# Altium schematic sheet I2C.SchDoc
size 420 x 297 mm; EDA_Number: ARTIQ; CompanyName: WUT ISE; Organization: WUT ISE; DocumentNumber: 18; SheetNumber: 13; ModifiedBy: -; Title2: I2C devices; ModifiedDate: -
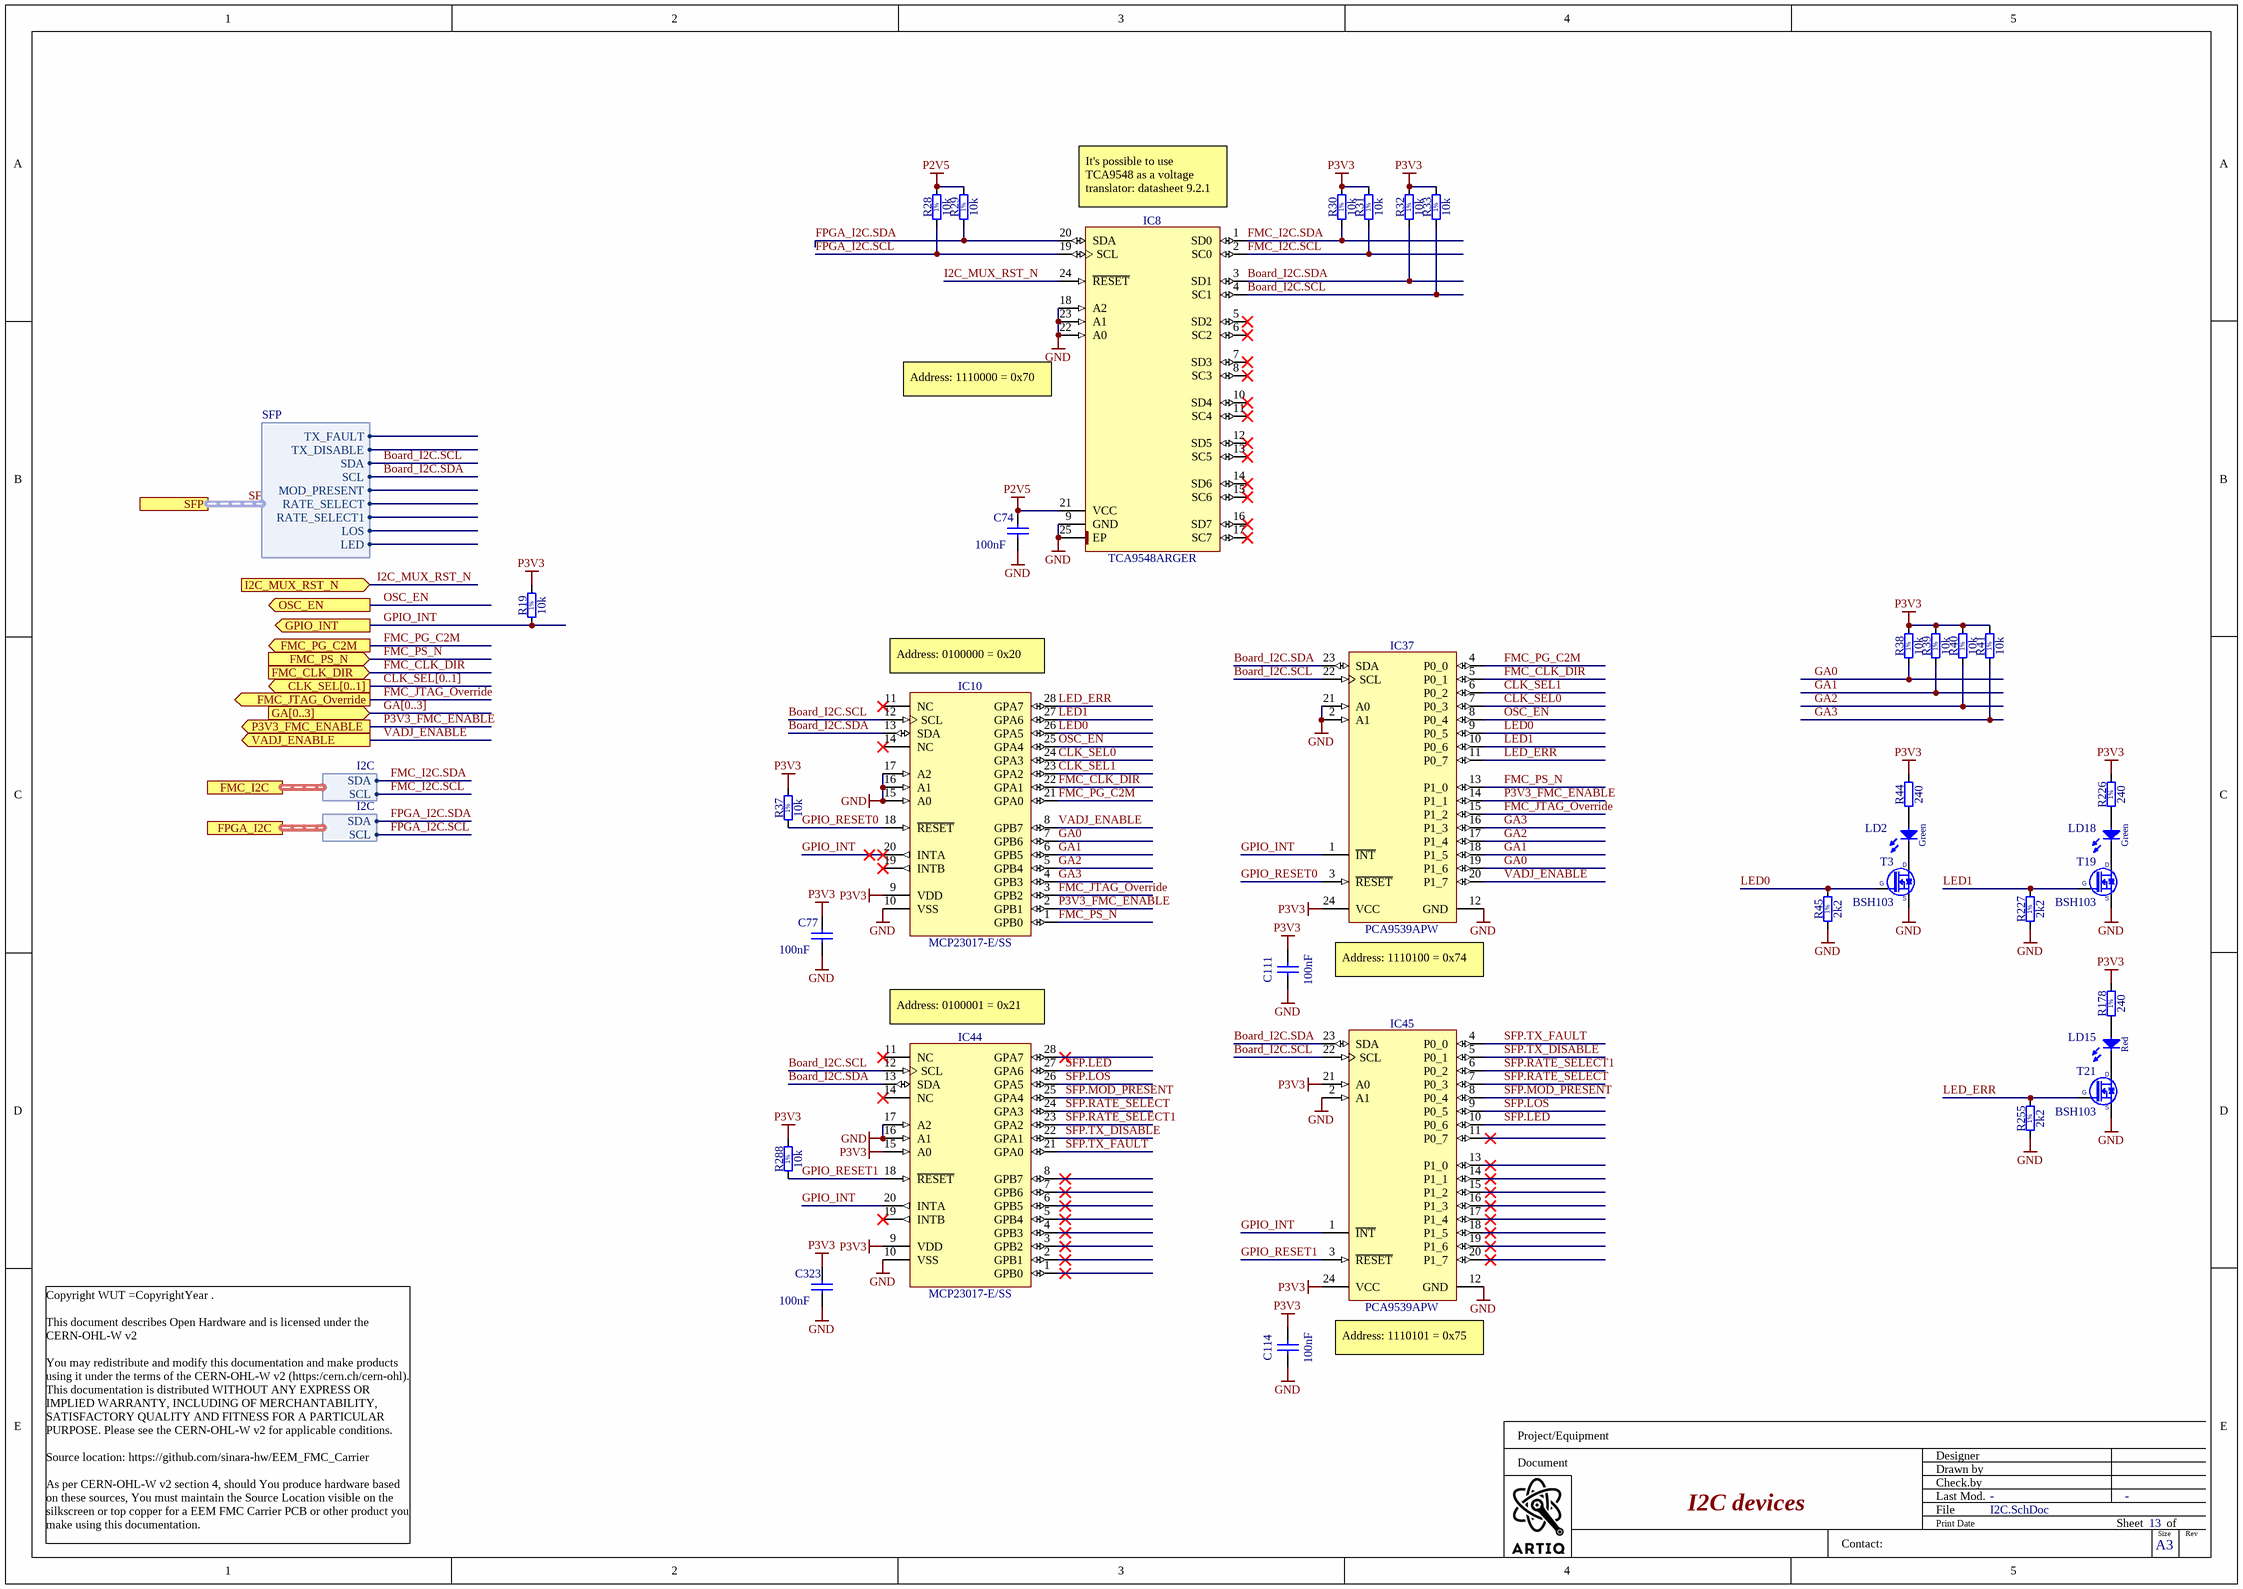
[diagram p0: I2C.SchDoc]

## Parts
C74  100nF  [CAPC1005X55N]
C77  100nF  [CAPC1005X55N]
C111  100nF  [CAPC0603X33N]
C114  100nF  [CAPC0603X33N]
C323  100nF  [CAPC1005X55N]
IC8  TCA9548ARGER  [QFN50P400X400X100-25N-S220]
IC10  MCP23017-E/SS  [SOP65P780X200-28N]
IC37  PCA9539APW  [SOP65P640X110-24N]
IC44  MCP23017-E/SS  [SOP65P780X200-28N]
IC45  PCA9539APW  [SOP65P640X110-24N]
LD2  Green  [LED_AVAGO_HSME-C120]
LD15  Red  [LED_AVAGO_HSMC-C120]
LD18  Green  [LED_AVAGO_HSME-C120]
R19  10k  [RESC1005X40N]
R28  10k  [RESC1005X40N]
R29  10k  [RESC1005X40N]
R30  10k  [RESC1005X40N]
R31  10k  [RESC1005X40N]
R32  10k  [RESC1005X40N]
R33  10k  [RESC1005X40N]
R37  10k  [RESC1005X40N]
R38  10k  [RESC1005X40N]
R39  10k  [RESC1005X40N]
R40  10k  [RESC1005X40N]
R41  10k  [RESC1005X40N]
R44  240  [RESC1005X40N]
R45  2k2  [RESC1005X40N]
R178  240  [RESC1005X40N]
R226  240  [RESC1005X40N]
R227  2k2  [RESC1005X40N]
R255  2k2  [RESC1005X40N]
R288  10k  [RESC1005X40N]
T3  BSH103  [SOT95P230X110-3N]
T19  BSH103  [SOT95P230X110-3N]
T21  BSH103  [SOT95P230X110-3N]

## Ports
CLK_SEL[0..1] (out), FMC_CLK_DIR (in), FMC_I2C (harness I2C), FMC_JTAG_Override (out), FMC_PG_C2M (out), FMC_PS_N (in), FPGA_I2C (harness I2C), GA[0..3] (in), GPIO_INT (out), I2C_MUX_RST_N (in), OSC_EN (out), P3V3_FMC_ENABLE (out), SFP (harness SFP), VADJ_ENABLE (out)

## Harnesses
I2C: SDA, SCL
SFP: TX_FAULT, LOS, MOD_PRESENT, TX_DISABLE, RATE_SELECT, LED, RATE_SELECT1, SDA, SCL

## Nets
GND: C74.1 C77.1 C111.1 C114.1 C323.1 IC8.9(GND) IC8.18(A2) IC8.22(A0) IC8.23(A1) IC8.25(EP) IC10.10(VSS) IC10.15(A0) IC10.16(A1) IC10.17(A2) IC37.2(A1) IC37.12(GND) IC37.21(A0) IC44.10(VSS) IC44.16(A1) IC44.17(A2) IC45.2(A1) IC45.12(GND) R45.1 R227.1 R255.1 T3.2(S) T19.2(S) T21.2(S)
P2V5: C74.2 IC8.21(VCC) R28.2 R29.2
P3V3: C77.2 C111.2 C114.2 C323.2 IC10.9(VDD) IC37.24(VCC) IC44.9(VDD) IC44.15(A0) IC45.21(A0) IC45.24(VCC) R19.2 R30.2 R31.2 R32.2 R33.2 R37.2 R38.2 R39.2 R40.2 R41.2 R44.2 R178.2 R226.2 R288.2
Board_I2C.SCL: IC8.4(SC1) IC10.12(SCL) IC37.22(SCL) IC44.12(SCL) IC45.22(SCL) R33.1 ; port SFP.SDA
Board_I2C.SDA: IC8.3(SD1) IC10.13(SDA) IC37.23(SDA) IC44.13(SDA) IC45.23(SDA) R32.1 ; port SFP.SCL
CLK_SEL0: IC10.24(GPA3) IC37.7(P0_3)
CLK_SEL1: IC10.23(GPA2) IC37.6(P0_2)
FMC_CLK_DIR: IC10.22(GPA1) IC37.5(P0_1) ; port FMC_CLK_DIR
FMC_I2C.SCL: IC8.2(SC0) R31.1 ; port FMC_I2C.SCL
FMC_I2C.SDA: IC8.1(SD0) R30.1 ; port FMC_I2C.SDA
FMC_JTAG_Override: IC10.3(GPB2) IC37.15(P1_2) ; port FMC_JTAG_Override
FMC_PG_C2M: IC10.21(GPA0) IC37.4(P0_0) ; port FMC_PG_C2M
FMC_PS_N: IC10.1(GPB0) IC37.13(P1_0) ; port FMC_PS_N
FPGA_I2C.SCL: IC8.19(SCL) R28.1 ; port FPGA_I2C.SCL
FPGA_I2C.SDA: IC8.20(SDA) R29.1 ; port FPGA_I2C.SDA
GA0: IC10.7(GPB6) IC37.19(P1_6) R38.1
GA1: IC10.6(GPB5) IC37.18(P1_5) R39.1
GA2: IC10.5(GPB4) IC37.17(P1_4) R40.1
GA3: IC10.4(GPB3) IC37.16(P1_3) R41.1
GPIO_INT: IC10.20(INTA) IC37.1(~{INT}) IC44.20(INTA) IC45.1(~{INT}) R19.1 ; port GPIO_INT
GPIO_RESET0: IC10.18(~{RESET}) IC37.3(~{RESET}) R37.1
GPIO_RESET1: IC44.18(~{RESET}) IC45.3(~{RESET}) R288.1
I2C_MUX_RST_N: IC8.24(~{RESET}) ; port I2C_MUX_RST_N
LED0: IC10.26(GPA5) IC37.9(P0_5) R45.2 T3.1(G)
LED1: IC10.27(GPA6) IC37.10(P0_6) R227.2 T19.1(G)
LED_ERR: IC10.28(GPA7) IC37.11(P0_7) R255.2 T21.1(G)
OSC_EN: IC10.25(GPA4) IC37.8(P0_4) ; port OSC_EN
P3V3_FMC_ENABLE: IC10.2(GPB1) IC37.14(P1_1) ; port P3V3_FMC_ENABLE
SFP.LED: IC44.27(GPA6) IC45.10(P0_6)
SFP.LOS: IC44.26(GPA5) IC45.9(P0_5)
SFP.MOD_PRESENT: IC44.25(GPA4) IC45.8(P0_4)
SFP.RATE_SELECT: IC44.24(GPA3) IC45.7(P0_3)
SFP.RATE_SELECT1: IC44.23(GPA2) IC45.6(P0_2)
SFP.TX_DISABLE: IC44.22(GPA1) IC45.5(P0_1)
SFP.TX_FAULT: IC44.21(GPA0) IC45.4(P0_0)
VADJ_ENABLE: IC10.8(GPB7) IC37.20(P1_7) ; port VADJ_ENABLE
NetLD2_1: LD2.1(C) T3.3(D)
NetLD2_2: LD2.2(A) R44.1
NetLD15_1: LD15.1(C) T21.3(D)
NetLD15_2: LD15.2(A) R178.1
NetLD18_1: LD18.1(C) T19.3(D)
NetLD18_2: LD18.2(A) R226.1

Not connected (* = marked no-connect by the designer): IC8 5(SD2)* 6(SC2)* 7(SD3)* 8(SC3)* 10(SD4)* 11(SC4)* 12(SD5)* 13(SC5)* 14(SD6)* 15(SC6)* 16(SD7)* 17(SC7)*; IC10 11(NC)* 14(NC)* 19(INTB)*; IC44 1(GPB0)* 2(GPB1)* 3(GPB2)* 4(GPB3)* 5(GPB4)* 6(GPB5)* 7(GPB6)* 8(GPB7)* 11(NC)* 14(NC)* 19(INTB)* 28(GPA7)*; IC45 11(P0_7)* 13(P1_0)* 14(P1_1)* 15(P1_2)* 16(P1_3)* 17(P1_4)* 18(P1_5)* 19(P1_6)* 20(P1_7)*

## Buses and harness runs
bus CLK_SEL[0..1] = port CLK_SEL[0..1]
bus GA[0..3] = port GA[0..3]
harness SFP = port SFP

## Notes on the sheet
- (near IC8) It's possible to use TCA9548 as a voltage translator: datasheet 9.2.1
- (near IC8) Address: 1110000 = 0x70
- (near IC10) Address: 0100000 = 0x20
- Address: 1110100 = 0x74
- (near IC44) Address: 0100001 = 0x21
- Address: 1110101 = 0x75
- Project/Equipment
- Document
- Designer
- Drawn by
- Check.by
- Copyright WUT =CopyrightYear .
  This document describes Open Hardware and is licensed under the CERN-OHL-W v2
  You may redistribute and modify this documentation and make products using it under the terms of the CERN-OHL-W v2 (https:/cern.ch/cern-ohl). This documentation is distributed WITHOUT ANY EXPRESS OR IMPLIED WARRANTY, INCLUDING OF MERCHANTABILITY, SATISFACTORY QUALITY AND FITNESS FOR A PARTICULAR PURPOSE. Please see the CERN-OHL-W v2 for applicable conditions.
  Source location: https://github.com/sinara-hw/EEM_FMC_Carrier
  As per CERN-OHL-W v2 section 4, should You produce hardware based on these sources, You must maintain the Source Location visible on the silkscreen or top copper for a EEM FMC Carrier PCB or other product you make using this documentation.
- Contact:
- File
- Last Mod.
- Print Date
- Sheet
- Size
- A3
- of
- Rev
- (in symbol R0402_2K2_1%_0.0625W_100PPM) 1%
- (in symbol R0402_10K_1%_0.0625W_100PPM) 1%
- (in symbol R0402_240R_1%_0.0625W_100PPM) 1%

## Library data of the parts
C74 C77 C323 = CC0402_100NF_16V_10%_X5R: Non-polarised capacitor; Part Description: SMD Multilayer Chip Ceramic Capacitor; Manufacturer: GENERIC; Manufacturer1 Part Number: GRM155R61C104KA88D; Voltage: 16V; TC: X5R; Tolerance: ±10%; Part Number: CC0402_100NF_16V_10%_X5R; Component Kind: Standard; Component Type: Standard; Pin Count: 2; Value: 100nF; Status: None; Manufacturer Part Number: CC0402_100NF_16V_10%_X5R; Case: 0402; Mounted: Yes; Socket: No; SMD: Yes; Sense: No; Manufacturer1 Example: MURATA; Manufacturer1 ComponentHeight: 0.55mm; HelpURL: \\cern.ch\dfs\Applications\Altium\Datasheets\CC0402_X5R_MURATA_GRM.pdf; Author: CERN DEM JLC; CreateDate: 10.12.2013; LatestRevisionDate: 10.12.2013
C111 C114 = CC0201_100NF_6.3V_10%_X5R: Non-polarised capacitor; Part Description: SMD Multilayer Chip Ceramic Capacitor; Manufacturer: GENERIC; Manufacturer1 Part Number: 02016D104KAT2A; Voltage: 6.3V; TC: X5R; Tolerance: ±10%; Part Number: CC0201_100NF_6.3V_10%_X5R; Component Kind: Standard; Component Type: Standard; Pin Count: 2; Value: 100nF; Status: Not Recommended; Manufacturer Part Number: CC0201_100NF_6.3V_10%_X5R; Case: 0201; Mounted: Yes; Socket: No; SMD: Yes; Sense: No; Manufacturer1 Example: AVX; Manufacturer1 ComponentHeight: 0.33mm; HelpURL: \\cern.ch\dfs\Applications\Altium\Datasheets\CC0201_X5R_AVX.pdf; Author: CERN DEM JLC; CreateDate: 2007-12-03; LatestRevisionDate: 2007-12-03
IC8 = TCA9548ARGER: Low Voltage 8-Channel I2C Switch With Reset; Manufacturer: TEXAS INSTRUMENTS; PressFit: No; Bonding: No; Part Number: TCA9548ARGER; Component Kind: Standard; Component Type: Standard; Device: TCA9548ARGER; PackageDescription: QFN, 0.50mm Pitch, Square; 24 Pin, 4.00mm L X 4.00mm W X 1.00mm H body (w/Thermal Tab 2.20 X 2.20mm), IPC Medium Density; Part Description: Low Voltage 8-Channel I2C Switch With Reset; Manufacturer Part Number: TCA9548ARGER; Pin Count: 25; Case: QFN24; Mounted: Yes; Socket: No; SMD: Yes; Sense: No; ComponentHeight: 1mm; Author: CERN DEM JLC; HelpURL: \\cern.ch\dfs\Applications\Altium\Datasheets\TCA9548ARGER.pdf; CreateDate: 2014-07-07; LatestRevisionDate: 2014-07-07
IC10 IC44 = MCP23017-E/SS: 16-bit I/O Port Expander With Serial Interface; Manufacturer: MICROCHIP TECHNOLOGY; PressFit: No; Bonding: No; Part Number: MCP23017-E/SS; Component Kind: Standard; Component Type: Standard; Device: MCP23017-E/SS; PackageDescription: SOP, 0.65mm Pitch; 28 Pin, 5.30mm W X 10.20mm L X 2.00mm H Body, IPC Medium Density; Part Description: 16-bit I/O Port Expander With Serial Interface; Manufacturer Part Number: MCP23017-E/SS; Pin Count: 28; Case: SSOP28; Mounted: Yes; Socket: No; SMD: Yes; Sense: No; ComponentHeight: 2mm; Author: CERN DEM JLC; HelpURL: \\cern.ch\dfs\Applications\Altium\Datasheets\MCP23017-E-SS.pdf; CreateDate: 17.01.2011; LatestRevisionDate: 17.01.2011
IC37 IC45 = PCA9539APW: Low-Voltage 16-Bit I2C-Bus I/O Port with Interrupt and Reset; Manufacturer: NXP SEMICONDUCTORS; PressFit: No; Bonding: No; Part Number: PCA9539APW; Component Kind: Standard; Component Type: Standard; Device: PCA9539APW; PackageDescription: SOP, 0.65mm Pitch; 24 Pin, 4.40mm W X 7.80mm L X 1.10mm H body, IPC Medium Density; Part Description: Low-Voltage 16-Bit I2C-Bus I/O Port with Interrupt and Reset; Manufacturer Part Number: PCA9539APW; Pin Count: 24; Case: TSSOP24; Mounted: Yes; Socket: No; SMD: Yes; Sense: No; ComponentHeight: 1.1mm; Author: CERN DEM JMW; HelpURL: \\cern.ch\dfs\Applications\Altium\Datasheets\PCA9539APW.pdf; CreateDate: 2020-08-06; LatestRevisionDate: 2020-08-06
LD2 LD18 = LED_AVAGO_HSME-C120: LED Green 1C 2A; Part Description: High Performance Right Angle Chip Green LED; Manufacturer: AVAGO TECHNOLOGIES; PressFit: No; Bonding: No; Manufacturer Part Number: HSME-C120; ComponentHeight: 0.7mm; HelpURL: \\cern.ch\dfs\Applications\Altium\Datasheets\LED_AVAGO_HSME-C120.pdf; Part Number: LED_AVAGO_HSME-C120; Component Kind: Standard; Component Type: Standard; Color: Green; PackageDescription: Green Chip LED, 2-Leads, Body 1.7x1.1mm, Side Emitting Package; Pin Count: 2; Mounted: Yes; Socket: No; SMD: Yes; Sense: No; Author: CERN DEM JMW; CreateDate: 22.07.2009; LatestRevisionDate: 20.06.2012; ComponentLink1URL: \\cern.ch\dfs\Applications\Altium\Datasheets\LED_AVAGO_HSME-C110_DESIGN-GUIDE.pdf; ComponentLink1Description: Design Guide
LD15 = LED_AVAGO_HSMC-C120: LED Red 1C 2A; Part Description: High Performance Right Angle Chip Red LED; Manufacturer: AVAGO TECHNOLOGIES; PressFit: No; Bonding: No; Manufacturer Part Number: HSMC-C120; ComponentHeight: 0.7mm; HelpURL: \\cern.ch\dfs\Applications\Altium\Datasheets\LED_AVAGO_HSMC-C120.pdf; Part Number: LED_AVAGO_HSMC-C120; Component Kind: Standard; Component Type: Standard; Color: Red; PackageDescription: Red Chip LED, 2-Leads, Body 1.7x1.1mm, Side Emitting Package; Pin Count: 2; Mounted: Yes; Socket: No; SMD: Yes; Sense: No; Author: CERN DEM JMW; CreateDate: 22.07.2009; LatestRevisionDate: 20.06.2012; ComponentLink1URL: \\cern.ch\dfs\Applications\Altium\Datasheets\LED_AVAGO_HSMC-C120_DESIGN-GUIDE.pdf; ComponentLink1Description: Design Guide
R19 R28-R33 R37-R41 R288 = R0402_10K_1%_0.0625W_100PPM: Resistor - 1%; Part Description: General Purpose Thick Film Chip Resistor; Manufacturer: GENERIC; Manufacturer1 Part Number: 232270671003L; TC: ±100ppm/°C; PressFit: No; Part Number: R0402_10K_1%_0.0625W_100PPM; Component Kind: Standard; Component Type: Standard; Pin Count: 2; Value: 10k; Status: Not Recommended; Power: 0.0625W; Tolerance: ±1%; Manufacturer Part Number: R0402_10K_1%_0.0625W_100PPM; Case: 0402; Mounted: Yes; Sense: No; Socket: No; SMD: Yes; Manufacturer1 Example: YAGEO PHYCOMP; Manufacturer1 ComponentHeight: 0.4mm; HelpURL: \\cern.ch\dfs\Applications\Altium\Datasheets\R0402_Phycomp_RC0402.pdf; Author: CERN DEM JLC; CreateDate: 03.12.2007; LatestRevisionDate: 17.10.2012
R44 R178 R226 = R0402_240R_1%_0.0625W_100PPM: Resistor - 1%; Part Description: General Purpose Thick Film Chip Resistor; Manufacturer: GENERIC; Manufacturer1 Part Number: 232270672401L; TC: ±100ppm/°C; PressFit: No; Part Number: R0402_240R_1%_0.0625W_100PPM; Component Kind: Standard; Component Type: Standard; Pin Count: 2; Value: 240; Status: Not Recommended; Power: 0.0625W; Tolerance: ±1%; Manufacturer Part Number: R0402_240R_1%_0.0625W_100PPM; Case: 0402; Mounted: Yes; Sense: No; Socket: No; SMD: Yes; Manufacturer1 Example: YAGEO PHYCOMP; Manufacturer1 ComponentHeight: 0.4mm; HelpURL: \\cern.ch\dfs\Applications\Altium\Datasheets\R0402_Phycomp_RC0402.pdf; Author: CERN DEM JLC; CreateDate: 03.12.2007; LatestRevisionDate: 17.10.2012
R45 R227 R255 = R0402_2K2_1%_0.0625W_100PPM: Resistor - 1%; Part Description: General Purpose Thick Film Chip Resistor; Manufacturer: GENERIC; Manufacturer1 Part Number: 232270672202L; TC: ±100ppm/°C; PressFit: No; Part Number: R0402_2K2_1%_0.0625W_100PPM; Component Kind: Standard; Component Type: Standard; Pin Count: 2; Value: 2k2; Status: Not Recommended; Power: 0.0625W; Tolerance: ±1%; Manufacturer Part Number: R0402_2K2_1%_0.0625W_100PPM; Case: 0402; Mounted: Yes; Sense: No; Socket: No; SMD: Yes; Manufacturer1 Example: YAGEO PHYCOMP; Manufacturer1 ComponentHeight: 0.4mm; HelpURL: \\cern.ch\dfs\Applications\Altium\Datasheets\R0402_Phycomp_RC0402.pdf; Author: CERN DEM JLC; CreateDate: 03.12.2007; LatestRevisionDate: 17.10.2012; ClassName: Artix
T3 T19 T21 = BSH103: N-CHANNEL MOSFET WITH DIODE; Part Description: 30V 850mA N-Channel Enhancement Mode Field-Effect Transistor; Manufacturer: NEXPERIA; PressFit: No; Bonding: No; Part Number: BSH103; Component Kind: Standard; Component Type: Standard; Device: BSH103; PackageDescription: SOT23, 3 pin, Pitch 0.95mm - 1.3mm W X 2.9mm L X 1.1mm H, IPC Medium Density; Manufacturer Part Number: BSH103; Pin Count: 3; Case: SOT23-3; Mounted: Yes; Socket: No; SMD: Yes; Sense: No; ComponentHeight: 1.1mm; HelpURL: \\cern.ch\dfs\Applications\Altium\Datasheets\BSH103.pdf; Author: CERN DEM JLC; CreateDate: 16.03.2010; LatestRevisionDate: 20.06.2017; ClassName: Artix